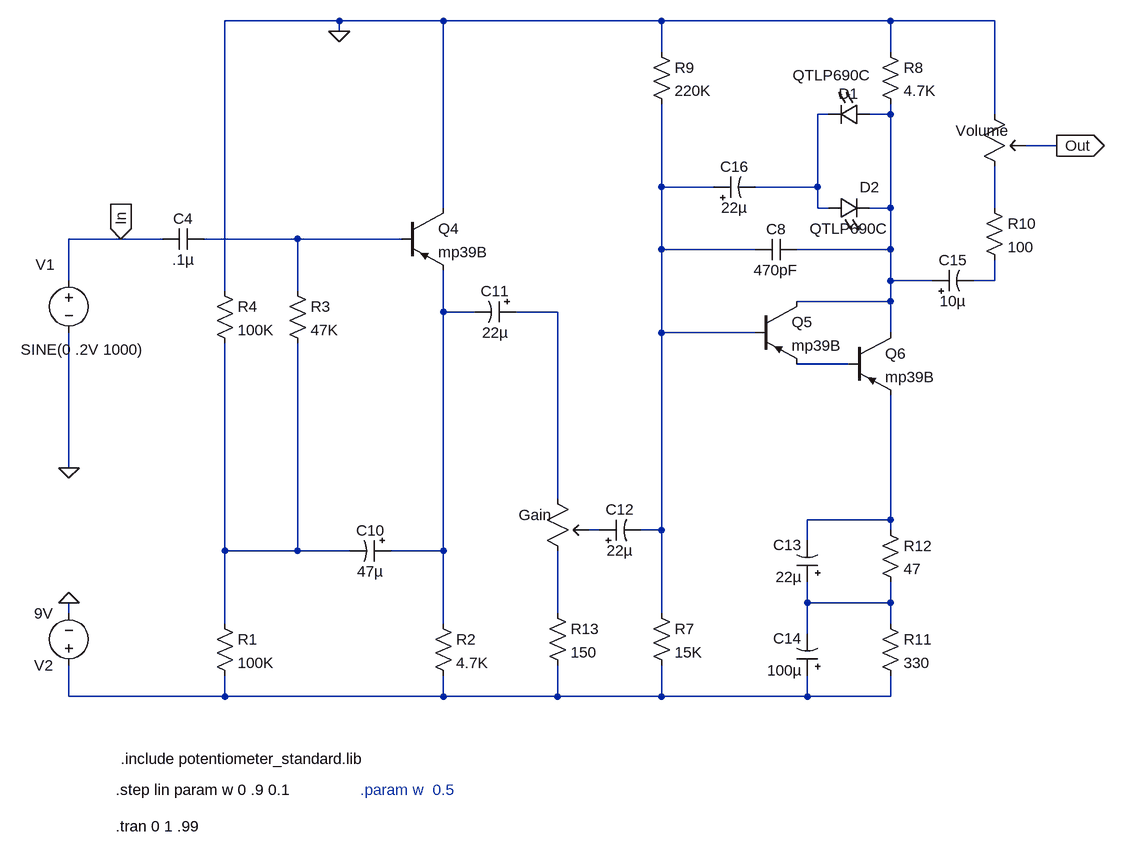
[diagram p0: schematic bjt screamer pnp darlington transitive.asc]
bjt screamer pnp darlington transitive.asc, the LTspice schematic file:
Version 4
SHEET 1 880 680
WIRE -1008 -1024 -1184 -1024
WIRE -848 -1024 -1008 -1024
WIRE -512 -1024 -848 -1024
WIRE -160 -1024 -512 -1024
WIRE 0 -1024 -160 -1024
WIRE -1008 -1008 -1008 -1024
WIRE -512 -976 -512 -1024
WIRE -160 -976 -160 -1024
WIRE -256 -880 -272 -880
WIRE -160 -880 -160 -896
WIRE -160 -880 -192 -880
WIRE 0 -880 0 -1024
WIRE 96 -832 48 -832
WIRE -512 -768 -512 -896
WIRE -432 -768 -512 -768
WIRE -272 -768 -272 -880
WIRE -272 -768 -368 -768
WIRE -848 -736 -848 -1024
WIRE -272 -736 -272 -768
WIRE -256 -736 -272 -736
WIRE -160 -736 -160 -880
WIRE -160 -736 -192 -736
WIRE 0 -736 0 -800
WIRE -1344 -688 -1424 -688
WIRE -1280 -688 -1344 -688
WIRE -1072 -688 -1216 -688
WIRE -912 -688 -1072 -688
WIRE -512 -672 -512 -768
WIRE -368 -672 -512 -672
WIRE -160 -672 -160 -736
WIRE -160 -672 -304 -672
WIRE -1424 -624 -1424 -688
WIRE -160 -624 -160 -672
WIRE -96 -624 -160 -624
WIRE 0 -624 0 -656
WIRE 0 -624 -32 -624
WIRE -1184 -608 -1184 -1024
WIRE -1072 -608 -1072 -688
WIRE -160 -592 -160 -624
WIRE -160 -592 -304 -592
WIRE -848 -576 -848 -640
WIRE -800 -576 -848 -576
WIRE -672 -576 -736 -576
WIRE -512 -544 -512 -672
WIRE -368 -544 -512 -544
WIRE -160 -544 -160 -592
WIRE -224 -496 -304 -496
WIRE -1424 -336 -1424 -544
WIRE -672 -288 -672 -576
WIRE -160 -256 -160 -448
WIRE -160 -256 -288 -256
WIRE -608 -240 -624 -240
WIRE -512 -240 -512 -544
WIRE -512 -240 -544 -240
WIRE -160 -240 -160 -256
WIRE -288 -224 -288 -256
WIRE -1184 -208 -1184 -528
WIRE -1072 -208 -1072 -528
WIRE -1072 -208 -1184 -208
WIRE -992 -208 -1072 -208
WIRE -848 -208 -848 -576
WIRE -848 -208 -928 -208
WIRE -288 -128 -288 -160
WIRE -160 -128 -160 -160
WIRE -160 -128 -288 -128
WIRE -1424 -112 -1424 -128
WIRE -672 -112 -672 -208
WIRE -512 -112 -512 -240
WIRE -1184 -96 -1184 -208
WIRE -848 -96 -848 -208
WIRE -160 -96 -160 -128
WIRE -288 -80 -288 -128
WIRE -1424 16 -1424 -32
WIRE -1184 16 -1184 -16
WIRE -1184 16 -1424 16
WIRE -848 16 -848 -16
WIRE -848 16 -1184 16
WIRE -672 16 -672 -32
WIRE -672 16 -848 16
WIRE -512 16 -512 -32
WIRE -512 16 -672 16
WIRE -288 16 -288 -16
WIRE -288 16 -512 16
WIRE -160 16 -160 -16
WIRE -160 16 -288 16
FLAG -1424 -336 0
FLAG -1424 -128 0
FLAG -1008 -1008 0
FLAG 96 -832 Out
IOPIN 96 -832 Out
FLAG -1344 -688 In
IOPIN -1344 -688 In
SYMBOL voltage -1424 -640 R0
WINDOW 39 -112 95 Left 2
WINDOW 3 -74 122 Left 2
WINDOW 0 -51 -9 Left 2
SYMATTR Value SINE(0 .2V 1000)
SYMATTR InstName V1
SYMATTR Value2 AC 1
SYMBOL voltage -1424 -16 R180
WINDOW 123 0 0 Left 2
WINDOW 39 24 -12 Left 2
SYMATTR InstName V2
SYMATTR Value 9V
SYMBOL res -1200 -112 R0
SYMATTR InstName R1
SYMATTR Value 100K
SYMBOL res -864 -112 R0
SYMATTR InstName R2
SYMATTR Value 4.7K
SYMBOL res -1088 -624 R0
SYMATTR InstName R3
SYMATTR Value 47K
SYMBOL res -1200 -624 R0
SYMATTR InstName R4
SYMATTR Value 100K
SYMBOL cap -1216 -704 R90
WINDOW 0 0 32 VBottom 2
WINDOW 3 32 32 VTop 2
SYMATTR InstName C4
SYMATTR Value .1µ
SYMBOL potentiometer_standard -688 -304 R0
WINDOW 0 -44 41 Left 2
WINDOW 3 -201 26 Invisible 2
SYMATTR InstName Gain
SYMATTR Value Rtot=10K wiper={w}
SYMATTR SpiceModel pot_lin
SYMBOL res -176 -992 R0
SYMATTR InstName R8
SYMATTR Value 4.7K
SYMBOL res -176 -112 R0
SYMATTR InstName R11
SYMATTR Value 330
SYMBOL res -528 -992 R0
SYMATTR InstName R9
SYMATTR Value 220K
SYMBOL res -528 -128 R0
SYMATTR InstName R7
SYMATTR Value 15K
SYMBOL LED -192 -896 R90
WINDOW 0 0 32 VBottom 2
WINDOW 3 -60 58 VTop 2
SYMATTR InstName D1
SYMATTR Value QTLP690C
SYMATTR Description Diode
SYMATTR Type diode
SYMBOL LED -256 -720 R270
WINDOW 0 32 64 VTop 2
WINDOW 3 0 32 VBottom 2
SYMATTR InstName D2
SYMATTR Value QTLP690C
SYMATTR Description Diode
SYMATTR Type diode
SYMBOL res -16 -752 R0
SYMATTR InstName R10
SYMATTR Value 100
SYMBOL cap -304 -688 R90
WINDOW 0 0 32 VBottom 2
WINDOW 3 32 32 VTop 2
SYMATTR InstName C8
SYMATTR Value 470pF
SYMBOL res -688 -128 R0
SYMATTR InstName R13
SYMATTR Value 150
SYMBOL potentiometer_standard -16 -896 R0
WINDOW 0 -44 41 Left 2
WINDOW 3 -201 26 Invisible 2
SYMATTR InstName Volume
SYMATTR Value Rtot=10K wiper=0
SYMATTR SpiceModel pot_lin
SYMBOL res -176 -256 R0
SYMATTR InstName R12
SYMATTR Value 47
SYMBOL pnp -912 -736 R0
SYMATTR InstName Q4
SYMATTR Value mp39B
SYMBOL pnp -368 -592 R0
SYMATTR InstName Q5
SYMATTR Value mp39B
SYMBOL pnp -224 -544 R0
SYMATTR InstName Q6
SYMATTR Value mp39B
SYMBOL polcap -928 -224 R90
WINDOW 0 0 32 VBottom 2
WINDOW 3 32 32 VTop 2
SYMATTR InstName C10
SYMATTR Value 47µ
SYMBOL polcap -736 -592 R90
WINDOW 0 0 32 VBottom 2
WINDOW 3 32 32 VTop 2
SYMATTR InstName C11
SYMATTR Value 22µ
SYMBOL polcap -608 -224 R270
WINDOW 0 32 32 VTop 2
WINDOW 3 0 32 VBottom 2
SYMATTR InstName C12
SYMATTR Value 22µ
SYMBOL polcap -272 -160 R180
WINDOW 0 24 57 Left 2
WINDOW 3 24 8 Left 2
SYMATTR InstName C13
SYMATTR Value 22µ
SYMBOL polcap -272 -16 R180
WINDOW 0 24 57 Left 2
WINDOW 3 24 8 Left 2
SYMATTR InstName C14
SYMATTR Value 100µ
SYMBOL polcap -96 -608 R270
WINDOW 0 32 32 VTop 2
WINDOW 3 0 32 VBottom 2
SYMATTR InstName C15
SYMATTR Value 10µ
SYMBOL polcap -432 -752 R270
WINDOW 0 32 32 VTop 2
WINDOW 3 0 32 VBottom 2
SYMATTR InstName C16
SYMATTR Value 22µ
TEXT -1344 112 Left 2 !.include potentiometer_standard.lib
TEXT -1352 160 Left 2 !.step lin param w 0 .9 0.1
TEXT -1352 216 Left 2 !.tran 0 1 .99
TEXT -976 160 Left 2 ;.param w  0.5

The netlist it stands for:
* bjt screamer pnp darlington transitive.asc
V1 In 0 SINE(0 .2V 1000) AC 1
V2 N015 0 9V
R1 N012 N015 100K
R2 N007 N015 4.7K
R3 N005 N012 47K
R4 0 N012 100K
C4 N005 In .1µ
XGain N008 N014 N011 pot_lin Rtot=10K wiper={w}  ; pins A B C
R8 0 N002 4.7K
R11 N013 N015 330
R9 0 N003 220K
R7 N003 N015 15K
D1 N002 N001 QTLP690C
D2 N001 N002 QTLP690C
R10 N004 N006 100
C8 N002 N003 470pF
R13 N014 N015 150
XVolume 0 N004 Out pot_lin Rtot=10K wiper=0  ; pins A B C
R12 N010 N013 47
Q4 0 N005 N007 0 mp39B
Q5 N002 N003 N009 0 mp39B
Q6 N002 N009 N010 0 mp39B
C10 N007 N012 47µ
C11 N008 N007 22µ
C12 N011 N003 22µ
C13 N013 N010 22µ
C14 N015 N013 100µ
C15 N002 N006 10µ
C16 N003 N001 22µ
.model D D
.lib standard.dio
.model NPN NPN
.model PNP PNP
.lib standard.bjt
.include potentiometer_standard.lib
.step lin param w 0 .9 0.1
.tran 0 1 .99
* .param w  0.5
.backanno
.end